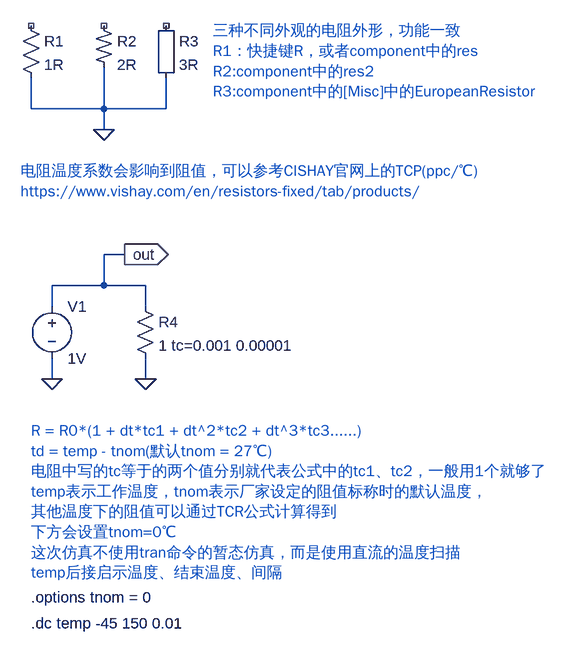
[diagram p0: schematic 10.电阻.asc]
10.电阻.asc, the LTspice schematic file:
Version 4
SHEET 1 880 1032
WIRE 16 224 16 176
WIRE 128 224 128 160
WIRE 128 224 16 224
WIRE 224 224 224 176
WIRE 224 224 128 224
WIRE 128 256 128 224
WIRE 160 448 128 448
WIRE 128 496 128 448
WIRE 128 496 48 496
WIRE 192 496 128 496
WIRE 48 528 48 496
WIRE 192 528 192 496
WIRE 48 640 48 608
WIRE 192 640 192 608
FLAG 128 256 0
FLAG 48 640 0
FLAG 192 640 0
FLAG 160 448 out
IOPIN 160 448 Out
SYMBOL res 0 80 R0
SYMATTR InstName R1
SYMATTR Value 1R
SYMBOL res2 112 96 R0
SYMATTR InstName R2
SYMATTR Value 2R
SYMBOL Misc\\EuropeanResistor 208 80 R0
SYMATTR InstName R3
SYMATTR Value 3R
SYMBOL voltage 48 512 R0
SYMATTR InstName V1
SYMATTR Value 1V
SYMBOL res 176 512 R0
SYMATTR InstName R4
SYMATTR Value 1 tc=0.001 0.00001
TEXT 296 104 Left 2 ;三种不同外观的电阻外形，功能一致\nR1：快捷键R，或者component中的res\nR2:component中的res2\nR3:component中的[Misc]中的EuropeanResistor
TEXT 0 320 Left 2 ;电阻温度系数会影响到阻值，可以参考CISHAY官网上的TCP(ppc/℃)\nhttps://www.vishay.com/en/resistors-fixed/tab/products/
TEXT 16 720 Left 2 ;R = R0*(1 + dt*tc1 + dt^2*tc2 + dt^3*tc3......)\ntd = temp - tnom(默认tnom = 27℃)\n电阻中写的tc等于的两个值分别就代表公式中的tc1、tc2，一般用1个就够了\ntemp表示工作温度，tnom表示厂家设定的阻值标称时的默认温度，\n其他温度下的阻值可以通过TCR公式计算得到\n下方会设置tnom=0℃\n这次仿真不使用tran命令的暂态仿真，而是使用直流的温度扫描\ntemp后接启示温度、结束温度、间隔
TEXT 16 976 Left 2 !.options tnom = 0
TEXT 16 1016 Left 2 !.dc temp -45 150 0.01

The netlist it stands for:
* 10.电阻.asc
R1 NC_01 0 1R
R2 NC_02 0 2R
R3 NC_03 0 3R
V1 out 0 1V
R4 out 0 1 tc=0.001 0.00001
* 三种不同外观的电阻外形，功能一致
* R1：快捷键R，或者component中的res
* R2:component中的res2
* R3:component中的[Misc]中的EuropeanResistor
* 电阻温度系数会影响到阻值，可以参考CISHAY官网上的TCP(ppc/℃)
* https://www.vishay.com/en/resistors-fixed/tab/products/
* R = R0*(1 + dt*tc1 + dt^2*tc2 + dt^3*tc3......)
* td = temp - tnom(默认tnom = 27℃)
* 电阻中写的tc等于的两个值分别就代表公式中的tc1、tc2，一般用1个就够了
* temp表示工作温度，tnom表示厂家设定的阻值标称时的默认温度，
* 其他温度下的阻值可以通过TCR公式计算得到
* 下方会设置tnom=0℃
* 这次仿真不使用tran命令的暂态仿真，而是使用直流的温度扫描
* temp后接启示温度、结束温度、间隔
.options tnom = 0
.dc temp -45 150 0.01
.backanno
.end